# Altium schematic sheet revisionlog.schdoc: Revision Log
size 431 x 279 mm; DrawnBy: Doug; Organization: Synapse Product Development, LLC.; Address1: 1511 6th Ave., Suite 400; Address2: Seattle, Washington 98101; Address3: 206.381.0898; Address4: www.synapse.com; SheetNumber: 2; SheetTotal: 2; PageSetup: Record=PageOptions|CenterHorizontal=True|CenterVertical=True|PrintScale=1.06|XCorrection=1.00|YCorrection=1.00|PrintKind=1|BorderSize=5000000|LeftOffset=0|BottomOffset=0|Orientation=2|PaperLength=4318|PaperWidth=2794|Scale=100|PaperSource=7|PrintQuality=200|MediaType=1|DitherType=10|PrintScaleMode=1|PaperKind=11x17|PaperIndex=3
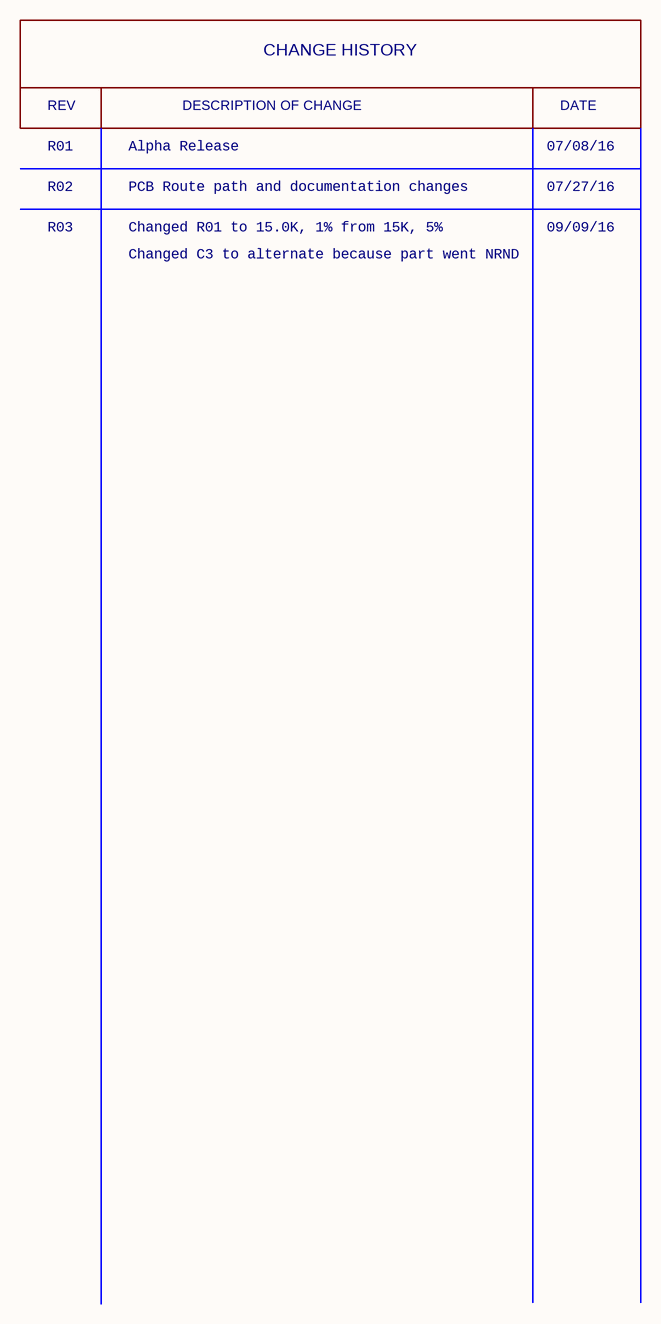
[diagram p0: revisionlog.schdoc]

## Notes on the sheet
- CHANGE HISTORY
- REV
- R01
- Alpha Release
- DESCRIPTION OF CHANGE
- 07/08/16
- DATE
- R02
- R03
- PCB Route path and documentation changes
- Changed R01 to 15.0K, 1% from 15K, 5%
- 07/27/16
- 09/09/16
- Changed C3 to alternate because part went NRND
- Design Notes:
- Layout Notes:
- Project:
- Sheet Title:
- PCBA:
- PROPRIETARY AND CONFIDENTIAL
- Drawn by:
- Schematic Part Number:
- Schematic Revision:
- Date:
- Sheet:
- /